# Altium schematic sheet LEDController.SchDoc (part 1 of 2)
size B
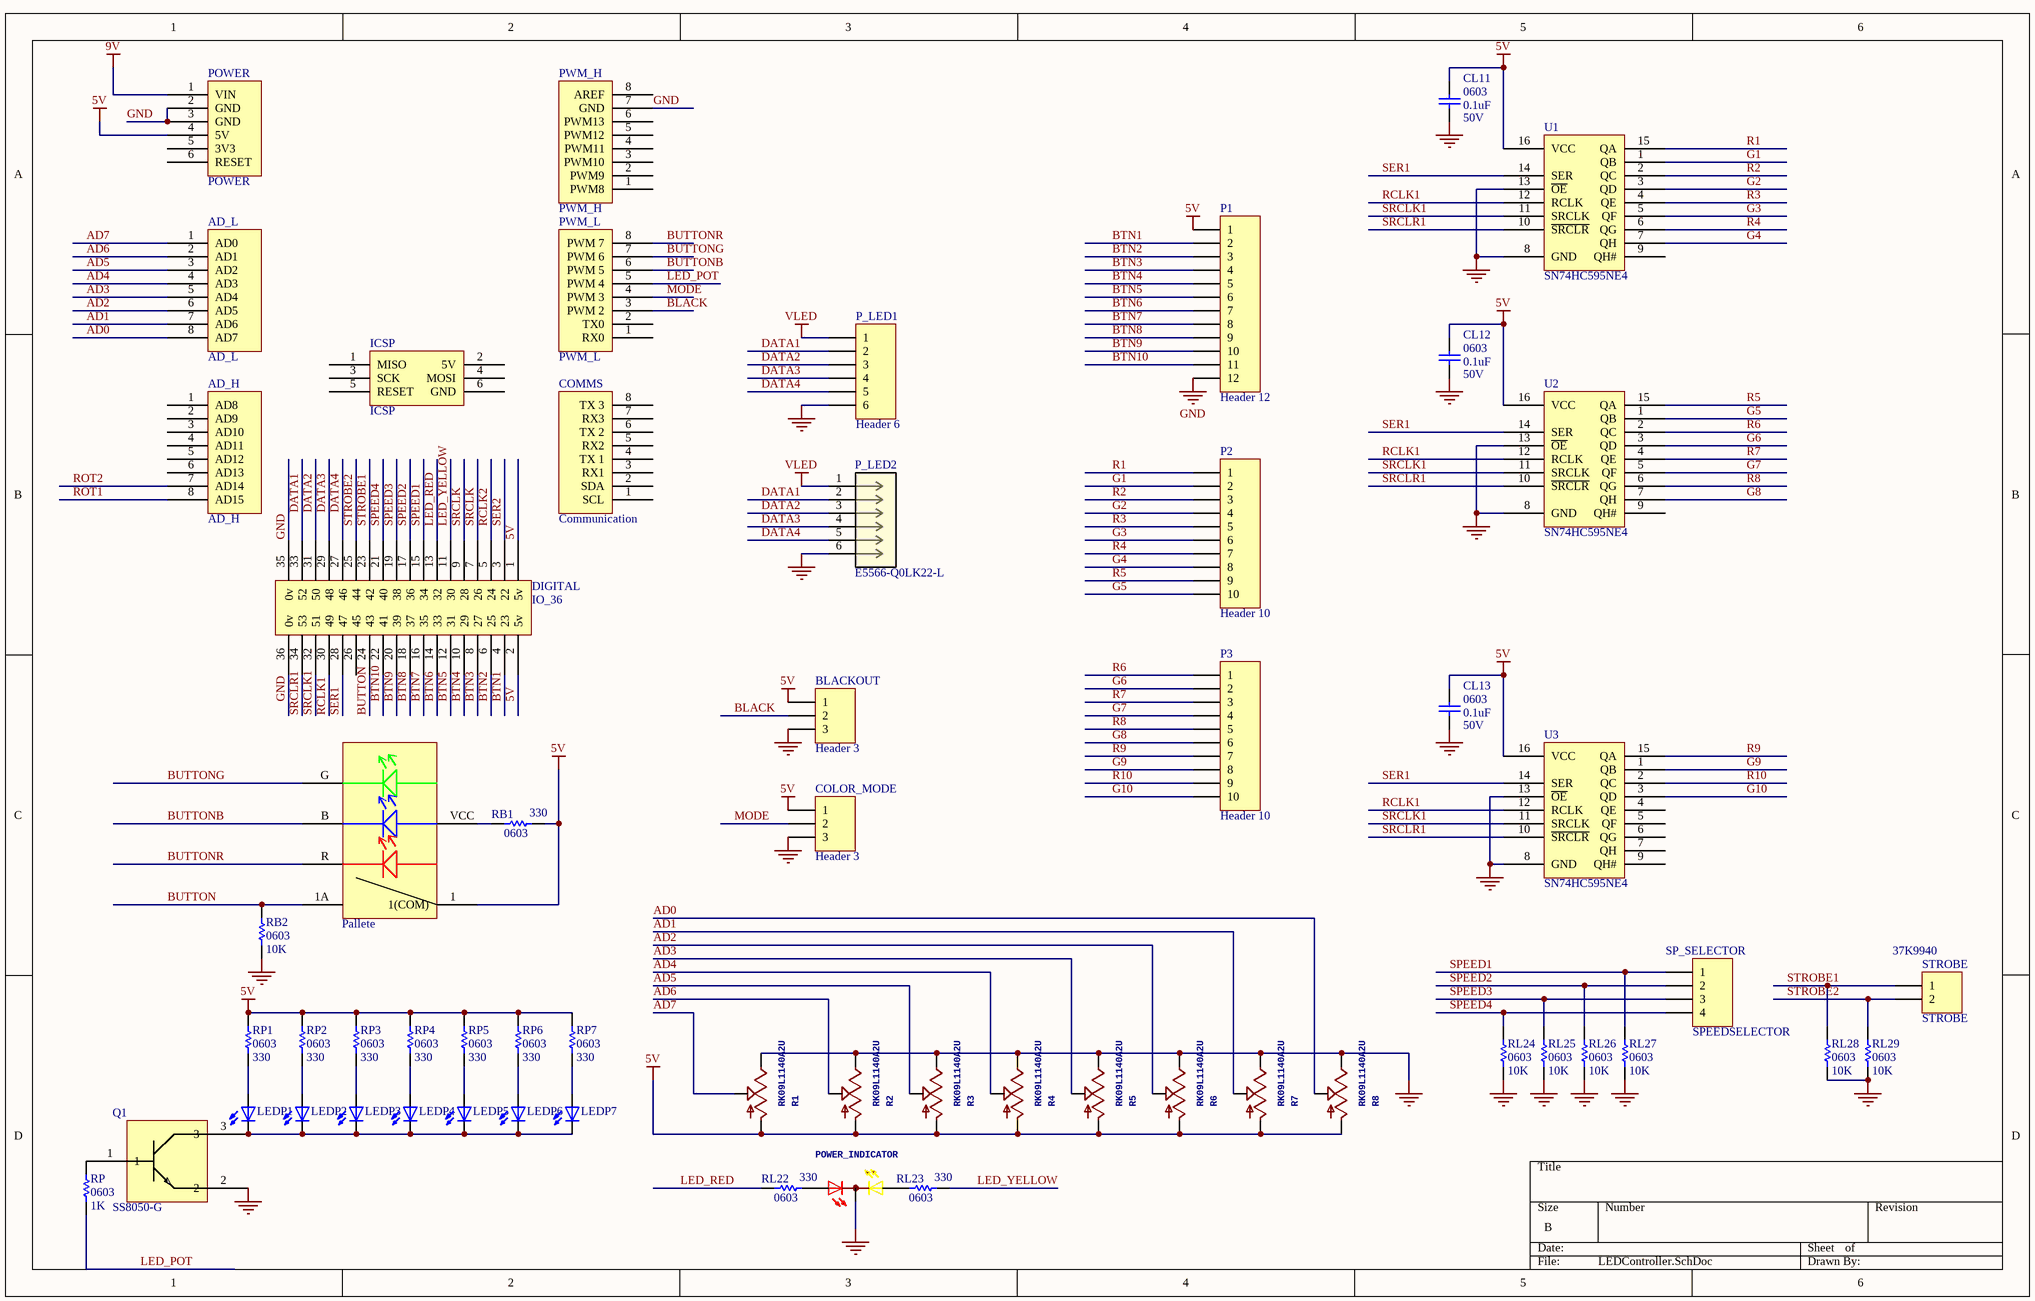
[diagram p0: LEDController.SchDoc]

## Parts
AD_H  AD_H  [Header 8x1 8.5mm]
AD_L  AD_L  [Header 8x1 8.5mm]
BLACKOUT  Header 3  [B3B-PH-K-S(LF)(SN)]
CL11  0603  value 0.1uF  Voltage Rating: 50V  [C0603]
CL12  0603  value 0.1uF  Voltage Rating: 50V  [C0603]
CL13  0603  value 0.1uF  Voltage Rating: 50V  [C0603]
COLOR_MODE  Header 3  [B3B-PH-K-S(LF)(SN)]
COMMS  Communication  [Header 8x1 8.5mm]
DIGITAL  IO_36  [HEADER 36X 8MM]
ICSP  ICSP  [ICSP]
LEDP1  150060AS75000  [LED-0603-Amber]  (value not drawn)
LEDP2  150060AS75000  [LED-0603-Amber]  (value not drawn)
LEDP3  150060AS75000  [LED-0603-Amber]  (value not drawn)
LEDP4  150060AS75000  [LED-0603-Amber]  (value not drawn)
LEDP5  150060AS75000  [LED-0603-Amber]  (value not drawn)
LEDP6  150060AS75000  [LED-0603-Amber]  (value not drawn)
LEDP7  150060AS75000  [LED-0603-Amber]  (value not drawn)
P1  Header 12  [12Pos Header]
P2  Header 10  [10POS HEADER]
P3  Header 10  [10POS HEADER]
P_LED1  Header 6  [HDR1X6]
P_LED2  E5566-Q0LK22-L  [E5566Q0LK22L]
Pallete  KP0115ANBKG03RGB-2SJB  [KP0115ANBKG03RGB-2SJB]  (value not drawn)
POWER  POWER  [Header 6x1 8.5mm]
POWER_INDICATOR  WP59EYW  [DUOLED-C-5MM]  (value not drawn)
PWM_H  PWM_H  [Header 8x1 8.5mm]
PWM_L  PWM_L  [Header 8x1 8.5mm]
Q1  SS8050-G  [TRAN_SS8050-G_CIP]
R1  RK09L1140A2U  [EVUFXM]
R2  RK09L1140A2U  [EVUFXM]
R3  RK09L1140A2U  [EVUFXM]
R4  RK09L1140A2U  [EVUFXM]
R5  RK09L1140A2U  [EVUFXM]
R6  RK09L1140A2U  [EVUFXM]
R7  RK09L1140A2U  [EVUFXM]
R8  RK09L1140A2U  [EVUFXM]
RB1  0603  value 330  [R0603]
RB2  0603  value 10K  [R0603]
RL22  0603  value 330  [R0603]
RL23  0603  value 330  [R0603]
RL24  0603  value 10K  [R0603]
RL25  0603  value 10K  [R0603]
RL26  0603  value 10K  [R0603]
RL27  0603  value 10K  [R0603]
RL28  0603  value 10K  [R0603]
RL29  0603  value 10K  [R0603]
RP  0603  value 1K  [R0603]
RP1  0603  value 330  [R0603]
RP2  0603  value 330  [R0603]
RP3  0603  value 330  [R0603]
RP4  0603  value 330  [R0603]
RP5  0603  value 330  [R0603]
RP6  0603  value 330  [R0603]
RP7  0603  value 330  [R0603]
SP_SELECTOR  SPEEDSELECTOR  [HDR1X4]
STROBE  STROBE  Supplier Part Number 1: 37K9940  [JST_B2B-PH-K-S(LF)(SN)]
U1  SN74HC595NE4  [DIP794W53P254L1930H508Q16N]
U2  SN74HC595NE4  [DIP794W53P254L1930H508Q16N]
U3  SN74HC595NE4  [DIP794W53P254L1930H508Q16N]

## Nets
5V: BLACKOUT.1 CL11.2 CL12.2 CL13.2 COLOR_MODE.1 DIGITAL.1(5v) DIGITAL.2(5v) P1.1 Pallete.1(1(COM)) POWER.4(5V) R1.1(A) R2.1(A) R3.1(A) R4.1(A) R5.1(A) R6.1(A) R7.1(A) R8.1(A) RB1.2 RP1.2 RP2.2 RP3.2 RP4.2 RP5.2 RP6.2 RP7.2 U1.16(VCC) U2.16(VCC) U3.16(VCC)
9V: POWER.1(VIN)
GND: BLACKOUT.3 CL11.1 CL12.1 CL13.1 COLOR_MODE.3 DIGITAL.35(0v) DIGITAL.36(0v) P1.12 P_LED1.6 P_LED2.6 POWER.2(GND) POWER.3(GND) POWER_INDICATOR.2 PWM_H.7(GND) Q1.2 R1.3(E) R2.3(E) R3.3(E) R4.3(E) R5.3(E) R6.3(E) R7.3(E) R8.3(E) RB2.2 RL24.2 RL25.2 RL26.2 RL27.2 RL28.2 RL29.2 U1.8(GND) U1.13(~{OE}) U2.8(GND) U2.13(~{OE}) U3.8(GND) U3.13(~{OE})
VLED: P_LED1.1 P_LED2.1
AD0: AD_L.8(AD7) R8.2(S)
AD1: AD_L.7(AD6) R7.2(S)
AD2: AD_L.6(AD5) R6.2(S)
AD3: AD_L.5(AD4) R5.2(S)
AD4: AD_L.4(AD3) R4.2(S)
AD5: AD_L.3(AD2) R3.2(S)
AD6: AD_L.2(AD1) R2.2(S)
AD7: AD_L.1(AD0) R1.2(S)
BLACK: BLACKOUT.2 PWM_L.3(PWM_2)
BTN1: DIGITAL.4(23) P1.2
BTN2: DIGITAL.6(25) P1.3
BTN3: DIGITAL.8(27) P1.4
BTN4: DIGITAL.10(29) P1.5
BTN5: DIGITAL.12(31) P1.6
BTN6: DIGITAL.14(33) P1.7
BTN7: DIGITAL.16(35) P1.8
BTN8: DIGITAL.18(37) P1.9
BTN9: DIGITAL.20(39) P1.10
BTN10: DIGITAL.22(41) P1.11
BUTTON: DIGITAL.24(43) Pallete.1A RB2.1
BUTTONB: Pallete.B(B(-)) PWM_L.6(PWM_5)
BUTTONG: Pallete.G(G(-)) PWM_L.7(PWM_6)
BUTTONR: Pallete.R(R(-)) PWM_L.8(PWM_7)
DATA1: DIGITAL.33(52) P_LED1.2 P_LED2.2
DATA2: DIGITAL.31(50) P_LED1.3 P_LED2.3
DATA3: DIGITAL.29(48) P_LED1.4 P_LED2.4
DATA4: DIGITAL.27(46) P_LED1.5 P_LED2.5
G1: P2.2 U1.1(QB)
G2: P2.4 U1.3(QD)
G3: P2.6 U1.5(QF)
G4: P2.8 U1.7(QH)
G5: P2.10 U2.1(QB)
G6: P3.2 U2.3(QD)
G7: P3.4 U2.5(QF)
G8: P3.6 U2.7(QH)
G9: P3.8 U3.1(QB)
G10: P3.10 U3.3(QD)
LED_POT: PWM_L.5(PWM_4) RP.2
LED_RED: DIGITAL.13(32) RL22.1
LED_YELLOW: DIGITAL.11(30) RL23.2
MODE: COLOR_MODE.2 PWM_L.4(PWM_3)
R1: P2.1 U1.15(QA)
R2: P2.3 U1.2(QC)
R3: P2.5 U1.4(QE)
R4: P2.7 U1.6(QG)
R5: P2.9 U2.15(QA)
R6: P3.1 U2.2(QC)
R7: P3.3 U2.4(QE)
R8: P3.5 U2.6(QG)
R9: P3.7 U3.15(QA)
R10: P3.9 U3.2(QC)
RCLK1: DIGITAL.30(49) U1.12(RCLK) U2.12(RCLK) U3.12(RCLK)
RCLK2: DIGITAL.5(24)
ROT1: AD_H.8(AD15)
ROT2: AD_H.7(AD14)
~{SRCLK}: DIGITAL.9(28)
~{SRCLR}1: DIGITAL.34(53) U1.10(~{SRCLR}) U2.10(~{SRCLR}) U3.10(~{SRCLR})
SER1: DIGITAL.28(47) U1.14(SER) U2.14(SER) U3.14(SER)
SER2: DIGITAL.3(22)
SPEED1: DIGITAL.15(34) RL27.1 SP_SELECTOR.1
SPEED2: DIGITAL.17(36) RL26.1 SP_SELECTOR.2
SPEED3: DIGITAL.19(38) RL25.1 SP_SELECTOR.3
SPEED4: DIGITAL.21(40) RL24.1 SP_SELECTOR.4
SRCLK: DIGITAL.7(26)
SRCLK1: DIGITAL.32(51) U1.11(SRCLK) U2.11(SRCLK) U3.11(SRCLK)
STROBE1: DIGITAL.23(42) RL28.1 STROBE.1
STROBE2: DIGITAL.25(44) RL29.1 STROBE.2
NetLEDP1_A: LEDP1.A RP1.1
NetLEDP1_C: LEDP1.C LEDP2.C LEDP3.C LEDP4.C LEDP5.C LEDP6.C LEDP7.C Q1.3
NetLEDP2_A: LEDP2.A RP2.1
NetLEDP3_A: LEDP3.A RP3.1
NetLEDP4_A: LEDP4.A RP4.1
NetLEDP5_A: LEDP5.A RP5.1
NetLEDP6_A: LEDP6.A RP6.1
NetLEDP7_A: LEDP7.A RP7.1
NetPallete_VCC: Pallete.VCC(3V3) RB1.1
NetPOWER_INDICATOR_1: POWER_INDICATOR.1 RL22.2
NetPOWER_INDICATOR_3: POWER_INDICATOR.3 RL23.1
NetQ1_1: Q1.1 RP.1

Not connected (* = marked no-connect by the designer): AD_H 1(AD8) 2(AD9) 3(AD10) 4(AD11) 5(AD12) 6(AD13); COMMS 1(SCL) 2(SDA) 3(RX1) 4(TX_1) 5(RX2) 6(TX_2) 7(RX3) 8(TX_3); DIGITAL 26(45); ICSP 1(MISO) 2(5V) 3(SCK) 4(MOSI) 5(RESET) 6(GND); POWER 5(3V3) 6(RESET); PWM_H 1(PWM8) 2(PWM9) 3(PWM10) 4(PWM11) 5(PWM12) 6(PWM13) 8(AREF); PWM_L 1(RX0) 2(TX0); U1 9(QH#); U2 9(QH#); U3 4(QE) 5(QF) 6(QG) 7(QH) 9(QH#)